# EAGLE design esp32_rc_car (EAGLE 9.6.2)
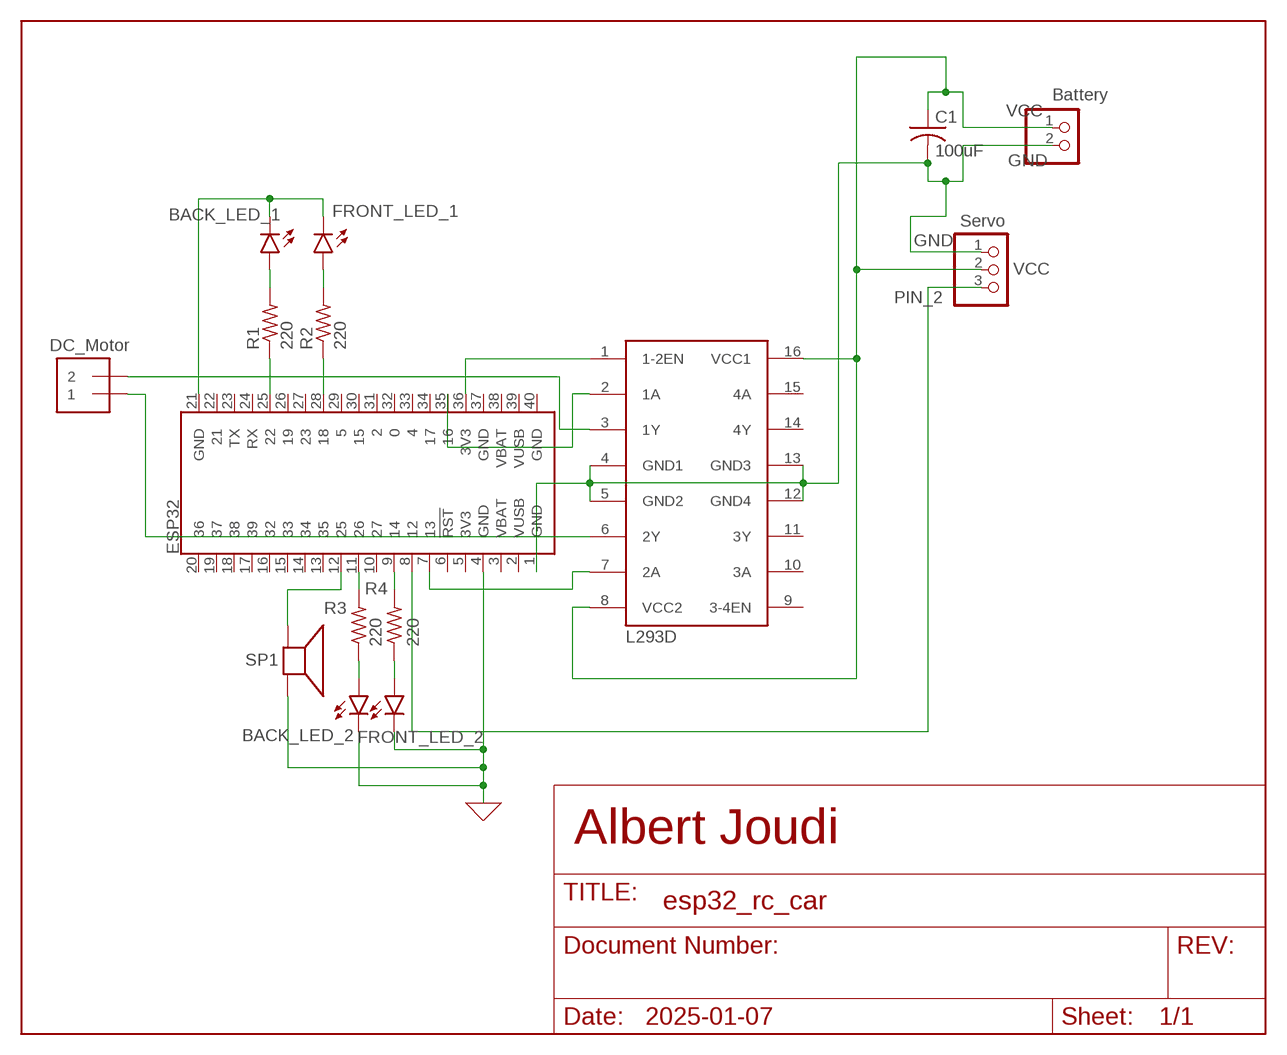
[diagram p0: schematic, sheet 1]

## Parts
BACK_LED_1  LED-5MM-KIT-NO-SILK  [LED_5MM-KIT-NO-SILK]
BACK_LED_2  LED-5MM-KIT-NO-SILK  [LED_5MM-KIT-NO-SILK]
BATTERY  PINHD-1X2  [1X02]
C1  100uF  C-US025-025X050  [C025-025X050]
DC_MOTOR  1X2-3.5MM  [1X2-3.5MM]
ESP32  ESP32_THING_W_ANT_KEEPOUT  [ESP32_THING]
FRONT_LED_1  LED-5MM-KIT-NO-SILK  [LED_5MM-KIT-NO-SILK]
FRONT_LED_2  LED-5MM-KIT-NO-SILK  [LED_5MM-KIT-NO-SILK]
IC1  L293D  [DIL16]
R1  220  R-US_0204/5  [0204/5]
R2  220  R-US_0204/5  [0204/5]
R3  220  R-US_0204/5  [0204/5]
R4  220  R-US_0204/5  [0204/5]
SERVO  PINHD-1X3  [1X03]
SP1  SPEAKER/AL11P  [AL11P]

## Nets
0: BACK_LED_2.K(C) ESP32.4(GND) FRONT_LED_2.K(C) SP1.- ; supply symbol labelled GND
GND: BATTERY.2 C1.2 ESP32.1(GND) IC1.4(GND1) IC1.5(GND2) IC1.12(GND4) IC1.13(GND3) SERVO.1
N$1: ESP32.12 SP1.+
N$2: ESP32.35 IC1.2(1A)
N$3: DC_MOTOR.2 IC1.3(1Y)
N$5: DC_MOTOR.1 IC1.6(2Y)
N$6: ESP32.7 IC1.7(2A)
N$7: BACK_LED_2.A R3.1
N$8: ESP32.28 R2.1
N$9: ESP32.11 R3.2
N$10: ESP32.25 R1.1
N$11: ESP32.9 R4.2
N$12: FRONT_LED_2.A R4.1
N$13: ESP32.36(3V3) IC1.1(1-2EN)
N$14: FRONT_LED_1.A R2.2
N$15: BACK_LED_1.A R1.2
N$16: BACK_LED_1.K(C) ESP32.21(GND) FRONT_LED_1.K(C)
PIN_2: ESP32.8 SERVO.3
VCC: BATTERY.1 C1.1 IC1.8(VCC2) IC1.16(VCC1) SERVO.2
Unconnected: ESP32.2(VUSB) ESP32.3(VBAT) ESP32.5(3V3) ESP32.6(!RST!) ESP32.10 ESP32.13 ESP32.14 ESP32.15 ESP32.16 ESP32.17 ESP32.18 ESP32.19 ESP32.20 ESP32.22 ESP32.23(TX) ESP32.24(RX) ESP32.26 ESP32.27 ESP32.29 ESP32.30 ESP32.31 ESP32.32 ESP32.33 ESP32.34 ESP32.37(GND) ESP32.38(VBAT) ESP32.39(VUSB) ESP32.40(GND) IC1.9(3-4EN) IC1.10(3A) IC1.11(3Y) IC1.14(4Y) IC1.15(4A)

## Notes on the sheet
- Battery
- Servo
- DC_Motor
- Albert Joudi
- 2025-01-07

## Library data of the parts
BACK_LED_1 BACK_LED_2 FRONT_LED_1 FRONT_LED_2 = SparkFun-LED:LED: LED (Generic) Standard schematic elements and footprints for 5mm, 3mm, 1206, and 0603 sized LEDs. Generic LEDs with no color specified.
BATTERY = pinhead:PINHD-1X2: PIN HEADER
C1 = adafruit:C-US: CAPACITOR, American symbol
DC_MOTOR = adafruit:1X2: 3.5mm Terminal block http://www.ladyada.net/library/pcb/eaglelibrary.html
ESP32 = SparkFun-Boards:ESP32_THING: SparkFun ESP32 Thing Board Pins, silkscreen, and logos matching the layout of the SparkFun ESP32 Thing <https://www.sparkfun.com/products/13907> Dimensions: 2.32" x 1.00"; SF_ID: DEV-13907
IC1 = st-microelectronics:L293D: PUSH-PULL 4 CHANNEL DRIVER; MPN: L293D; OC_FARNELL: 9589619; OC_NEWARK: 56P8249
R1-R4 = adafruit:R-US_: RESISTOR, American symbol
SERVO = adafruit:PINHD-1X3: PIN HEADER
SP1 = adafruit:SPEAKER: SPEAKER Source: Buerklin Added PS12 (for part # PS1240 piezo) http://www.ladyada.net/library/pcb/eaglelibrary.html

## Board
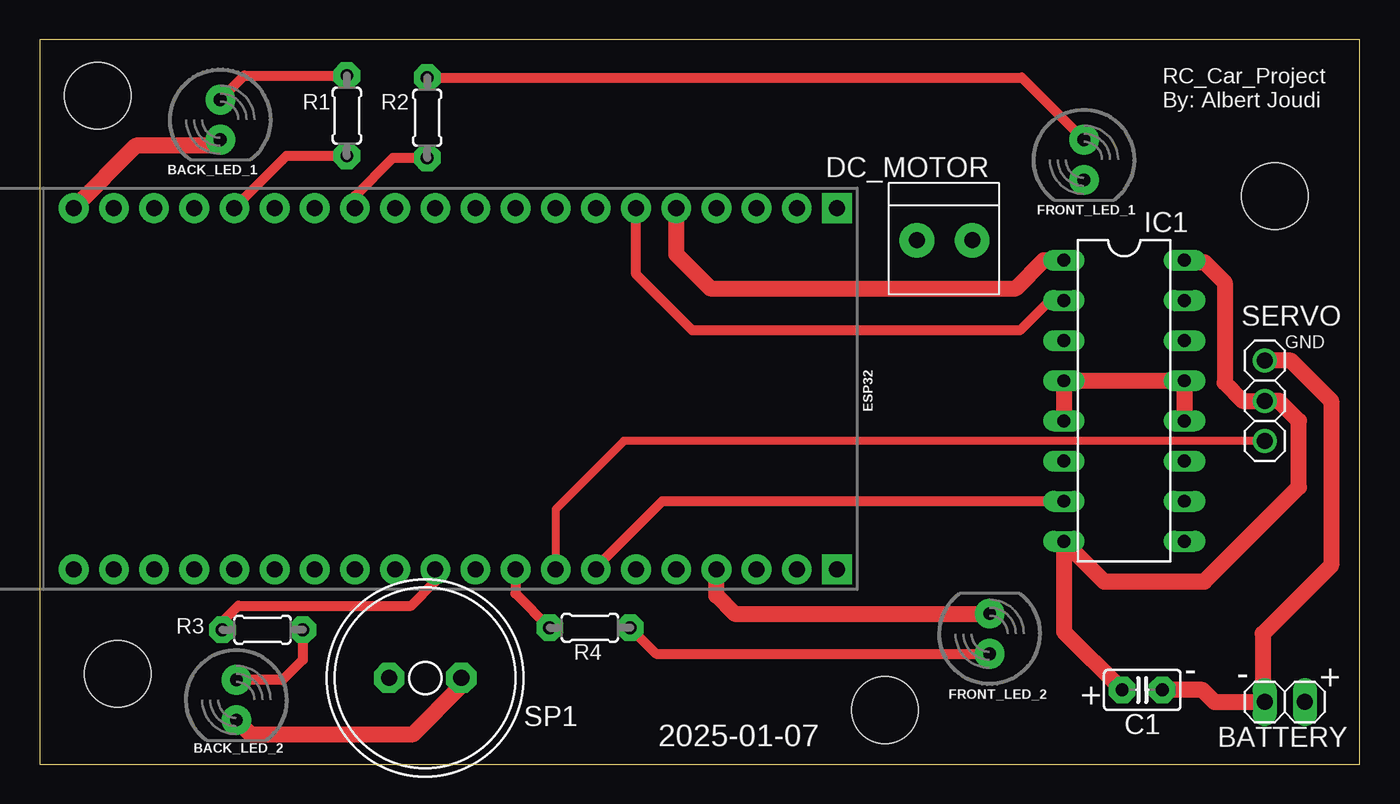
[diagram p1: board, top side]
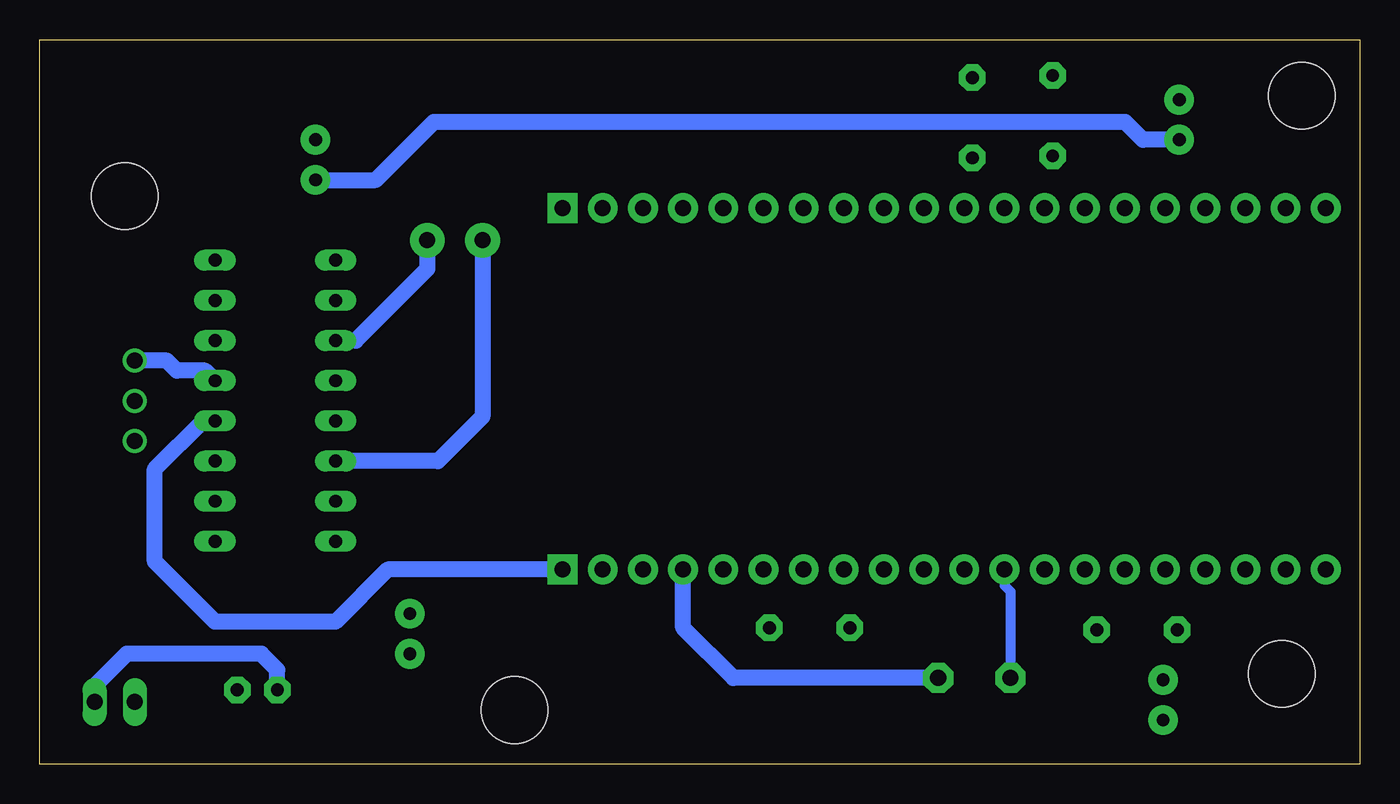
[diagram p2: board, bottom side, seen from below]

Size 83.49 x 45.84 mm. Coordinates in mm from the lower left corner, seen from the top.
Outline: 0,0 83.49,0 83.49,45.84 0,45.84 0,0
Copper layers (1*16): Top 0.035mm / dielectric 1.5mm / Bottom 0.035mm
Design rules "default *": minimum track width 20mil, minimum drill 0.35mm, track to track 10mil, track to pad 10mil, pad to pad 10mil, via to via 10mil, smd to smd 10mil, copper to edge 40mil, drill to drill 6mil, minimum pad ring 10mil, minimum via ring 8mil, stop-mask expansion 4mil, vias tented up to drill 0mil, thermal gap 10mil
Holes 4.2 mm at 3.68,42.29 4.95,5.71 78.11,35.94 53.47,3.43

### Footprints (pad centres in the part's own frame; a part is rotated, then mirrored left to right if it is on the bottom)
LED_5MM-KIT-NO-SILK = drill 0.813 pad 1.88: A -1.27,0; K 1.27,0
1X02 = drill 1.016 long: 1 -1.27,0; 2 1.27,0
C025-025X050 = drill 0.813 pad 1.676 octagon: 1 -1.27,0; 2 1.27,0
1X2-3.5MM = drill 1 pad 2.184: 1 1.8,0; 2 -1.7,0
ESP32_THING = drill 1.016 pad 1.88 square: 1 1.27,1.27; 40 24.13,1.27 | drill 1.016 pad 1.88: 2 1.27,3.81; 3 1.27,6.35; 4 1.27,8.89; 5 1.27,11.43; 6 1.27,13.97; 7 1.27,16.51; 8 1.27,19.05; 9 1.27,21.59; 10 1.27,24.13; 11 1.27,26.67; 12 1.27,29.21; 13 1.27,31.75; 14 1.27,34.29; 15 1.27,36.83; 16 1.27,39.37; 17 1.27,41.91; 18 1.27,44.45; 19 1.27,46.99; 20 1.27,49.53; 21 24.13,49.53; 22 24.13,46.99; 23 24.13,44.45; 24 24.13,41.91; 25 24.13,39.37; 26 24.13,36.83; 27 24.13,34.29; 28 24.13,31.75; 29 24.13,29.21; 30 24.13,26.67; 31 24.13,24.13; 32 24.13,21.59; 33 24.13,19.05; 34 24.13,16.51; 35 24.13,13.97; 36 24.13,11.43; 37 24.13,8.89; 38 24.13,6.35; 39 24.13,3.81
DIL16 = drill 0.813 long: 1 -8.89,-3.81; 2 -6.35,-3.81; 3 -3.81,-3.81; 4 -1.27,-3.81; 5 1.27,-3.81; 6 3.81,-3.81; 7 6.35,-3.81; 8 8.89,-3.81; 9 8.89,3.81; 10 6.35,3.81; 11 3.81,3.81; 12 1.27,3.81; 13 -1.27,3.81; 14 -3.81,3.81; 15 -6.35,3.81; 16 -8.89,3.81
0204/5 = drill 0.813 pad 1.676 octagon: 1 -2.54,0; 2 2.54,0
1X03 = drill 1.016: 1 -2.54,0; 2 0,0; 3 2.54,0
AL11P = drill 1.016 pad 1.905 octagon: + 2.286,0; - -2.286,0

### Placement (x,y rotation side)
BACK_LED_1  11.43,40.77 270 top
BACK_LED_2  12.45,4.06 270 top
BATTERY  78.74,3.94 180 top
C1  69.72,4.7 0 top
DC_MOTOR  57.28,33.15 180 top
ESP32  51.69,11.05 90 top
FRONT_LED_1  66.04,38.23 270 top
FRONT_LED_2  60.07,8.26 90 top
IC1  68.58,22.99 270 top
R1  19.43,41.02 90 top
R2  24.51,40.89 90 top
R3  14.1,8.51 180 top
R4  34.8,8.64 180 top
SERVO  77.47,22.99 270 top
SP1  24.38,5.46 180 top

### Tracks (layer width: path | path; a pad name or v marks a point on that pad's centre or on a via)
0
  Top 1.016: FRONT_LED_2.K 43.94,9.53 42.8,10.67 ESP32.4 | BACK_LED_2.K 13.34,1.91 23.62,1.91 26.67,4.95 SP1.-
  Bottom 1.016: SP1.- 39.62,5.46 42.8,8.64 ESP32.4
GND
  Top 1.016: SERVO.1 79.12,25.53 81.66,22.99 81.66,12.57 77.34,8.26 77.34,4.06 BATTERY.2 74.3,3.94 73.53,4.7 C1.2 | IC1.12 IC1.13 IC1.4 IC1.5
  Bottom 1.016: ESP32.1 61.47,12.32 64.77,9.02 72.39,9.02 76.2,12.83 76.2,18.67 73.15,21.72 IC1.12 | IC1.13 73.03,24.89 74.8,24.89 75.44,25.53 SERVO.1
N$1
  Bottom 0.635: ESP32.12 22.48,11.3 22.1,10.92 SP1.+
N$2
  Top 0.635: IC1.2 63.88,29.34 61.98,27.43 41.27,27.43 37.72,30.99 ESP32.35
N$3
  Bottom 1.016: DC_MOTOR.2 58.98,31.32 63.5,26.8 IC1.3
N$5
  Bottom 1.016: DC_MOTOR.1 55.48,21.99 58.29,19.18 IC1.6
N$6
  Top 0.635: IC1.7 39.37,16.64 35.18,12.45 ESP32.7
N$7
  Top 0.635: R3.1 16.64,6.6 15.37,5.33 BACK_LED_2.A
N$8
  Top 0.635: ESP32.28 19.94,35.94 22.35,38.35 R2.1
N$9
  Top 0.635: R3.2 11.56,9.02 12.57,10.03 23.5,10.03 25.02,11.56 ESP32.11
N$10
  Top 0.635: R1.1 15.62,38.48 ESP32.25
N$11
  Top 0.635: ESP32.9 30.1,10.79 R4.2
N$12
  Top 0.635: R4.1 38.99,6.99 FRONT_LED_2.A
N$13
  Top 1.016: ESP32.36 40.26,32.26 42.42,30.1 61.72,30.1 63.5,31.88 IC1.1
N$14
  Top 0.635: R2.2 62.1,43.43 FRONT_LED_1.A
N$15
  Top 0.635: BACK_LED_1.A 12.95,43.56 R1.2
N$16
  Top 1.016: ESP32.21 6.1,39.12 11.05,39.12 BACK_LED_1.K
  Bottom 1.016: BACK_LED_1.K 13.72,39.5 14.86,40.64 58.55,40.64 62.23,36.96 FRONT_LED_1.K
PIN_2
  Top 0.508: ESP32.8 32.64,16.13 36.96,20.45 SERVO.3
VCC
  Top 1.016: C1.1 64.77,8.38 IC1.8 67.31,11.56 73.66,11.56 79.63,17.53 79.63,21.72 78.36,22.99 SERVO.2 76.07,22.99 74.93,24.13 74.93,30.48 73.66,31.75 72.52,31.75 IC1.16
  Bottom 1.016: C1.1 68.45,5.97 69.47,6.99 77.98,6.99 80.01,4.95 BATTERY.1

### Text on the board
tPlace: RC_Car_Project / By: Albert Joudi | 2025-01-07
tNames: GND | - | - | + | +